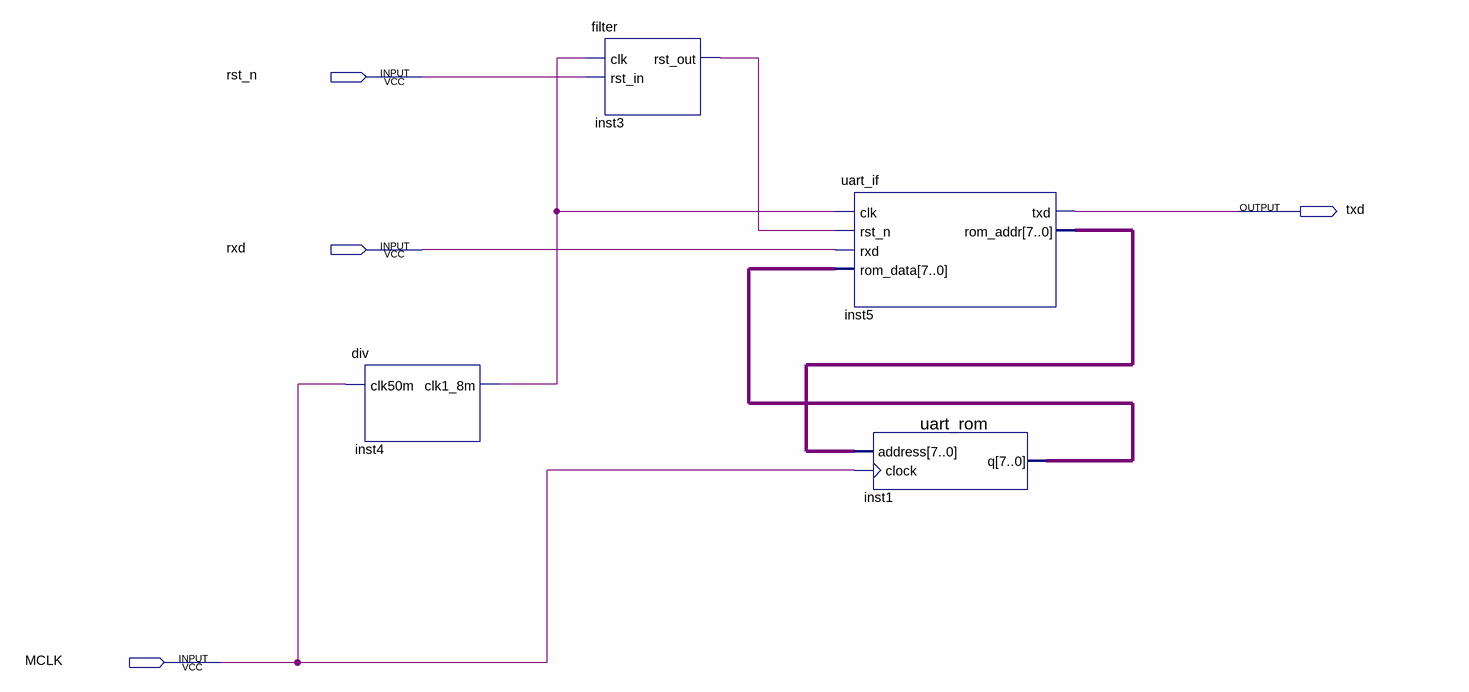
[diagram p0: schematic sheet]
// Quartus schematic uart_if_rom.bdf as structural Verilog: 4 symbols, 4 pins
module uart_if_rom (
  input  rst_n,
  input  rxd,
  input  MCLK,
  output txd
);

  wire inst3_rst_out, inst4_clk1_8m;
  wire [7:0] inst1_q, inst5_rom_addr;

  div inst4 (.clk50m(MCLK), .clk1_8m(inst4_clk1_8m));
  filter inst3 (.clk(inst4_clk1_8m), .rst_in(rst_n), .rst_out(inst3_rst_out));
  uart_if inst5 (
    .clk(inst4_clk1_8m), .rst_n(inst3_rst_out), .rxd(rxd), .rom_data(inst1_q), .txd(txd),
    .rom_addr(inst5_rom_addr));
  uart_rom inst1 (.address(inst5_rom_addr), .clock(MCLK), .q(inst1_q));
endmodule
